# Altium schematic sheet CAN_controller.SchDoc: MCORD AFE
size 420 x 297 mm; Author: G.Kasprowicz; CompanyName: WUT ISE; DrawnBy: G.Kasprowicz; Organization: WUT ISE; Address1: PW ISE; Address2: Nowowiejska 15/19 00-665 Warsaw; Address3: gkasprow@gmail.com; DocumentNumber: 3; Revision: 2; SheetNumber: 3; SheetTotal: 4; ModifiedBy: -; CheckedDate: -; Title2: CAN controller; DivGrp: WUT ISE; Designer: G.Kasprowicz; ModifiedDate: -; ProjectName: Sensor Box
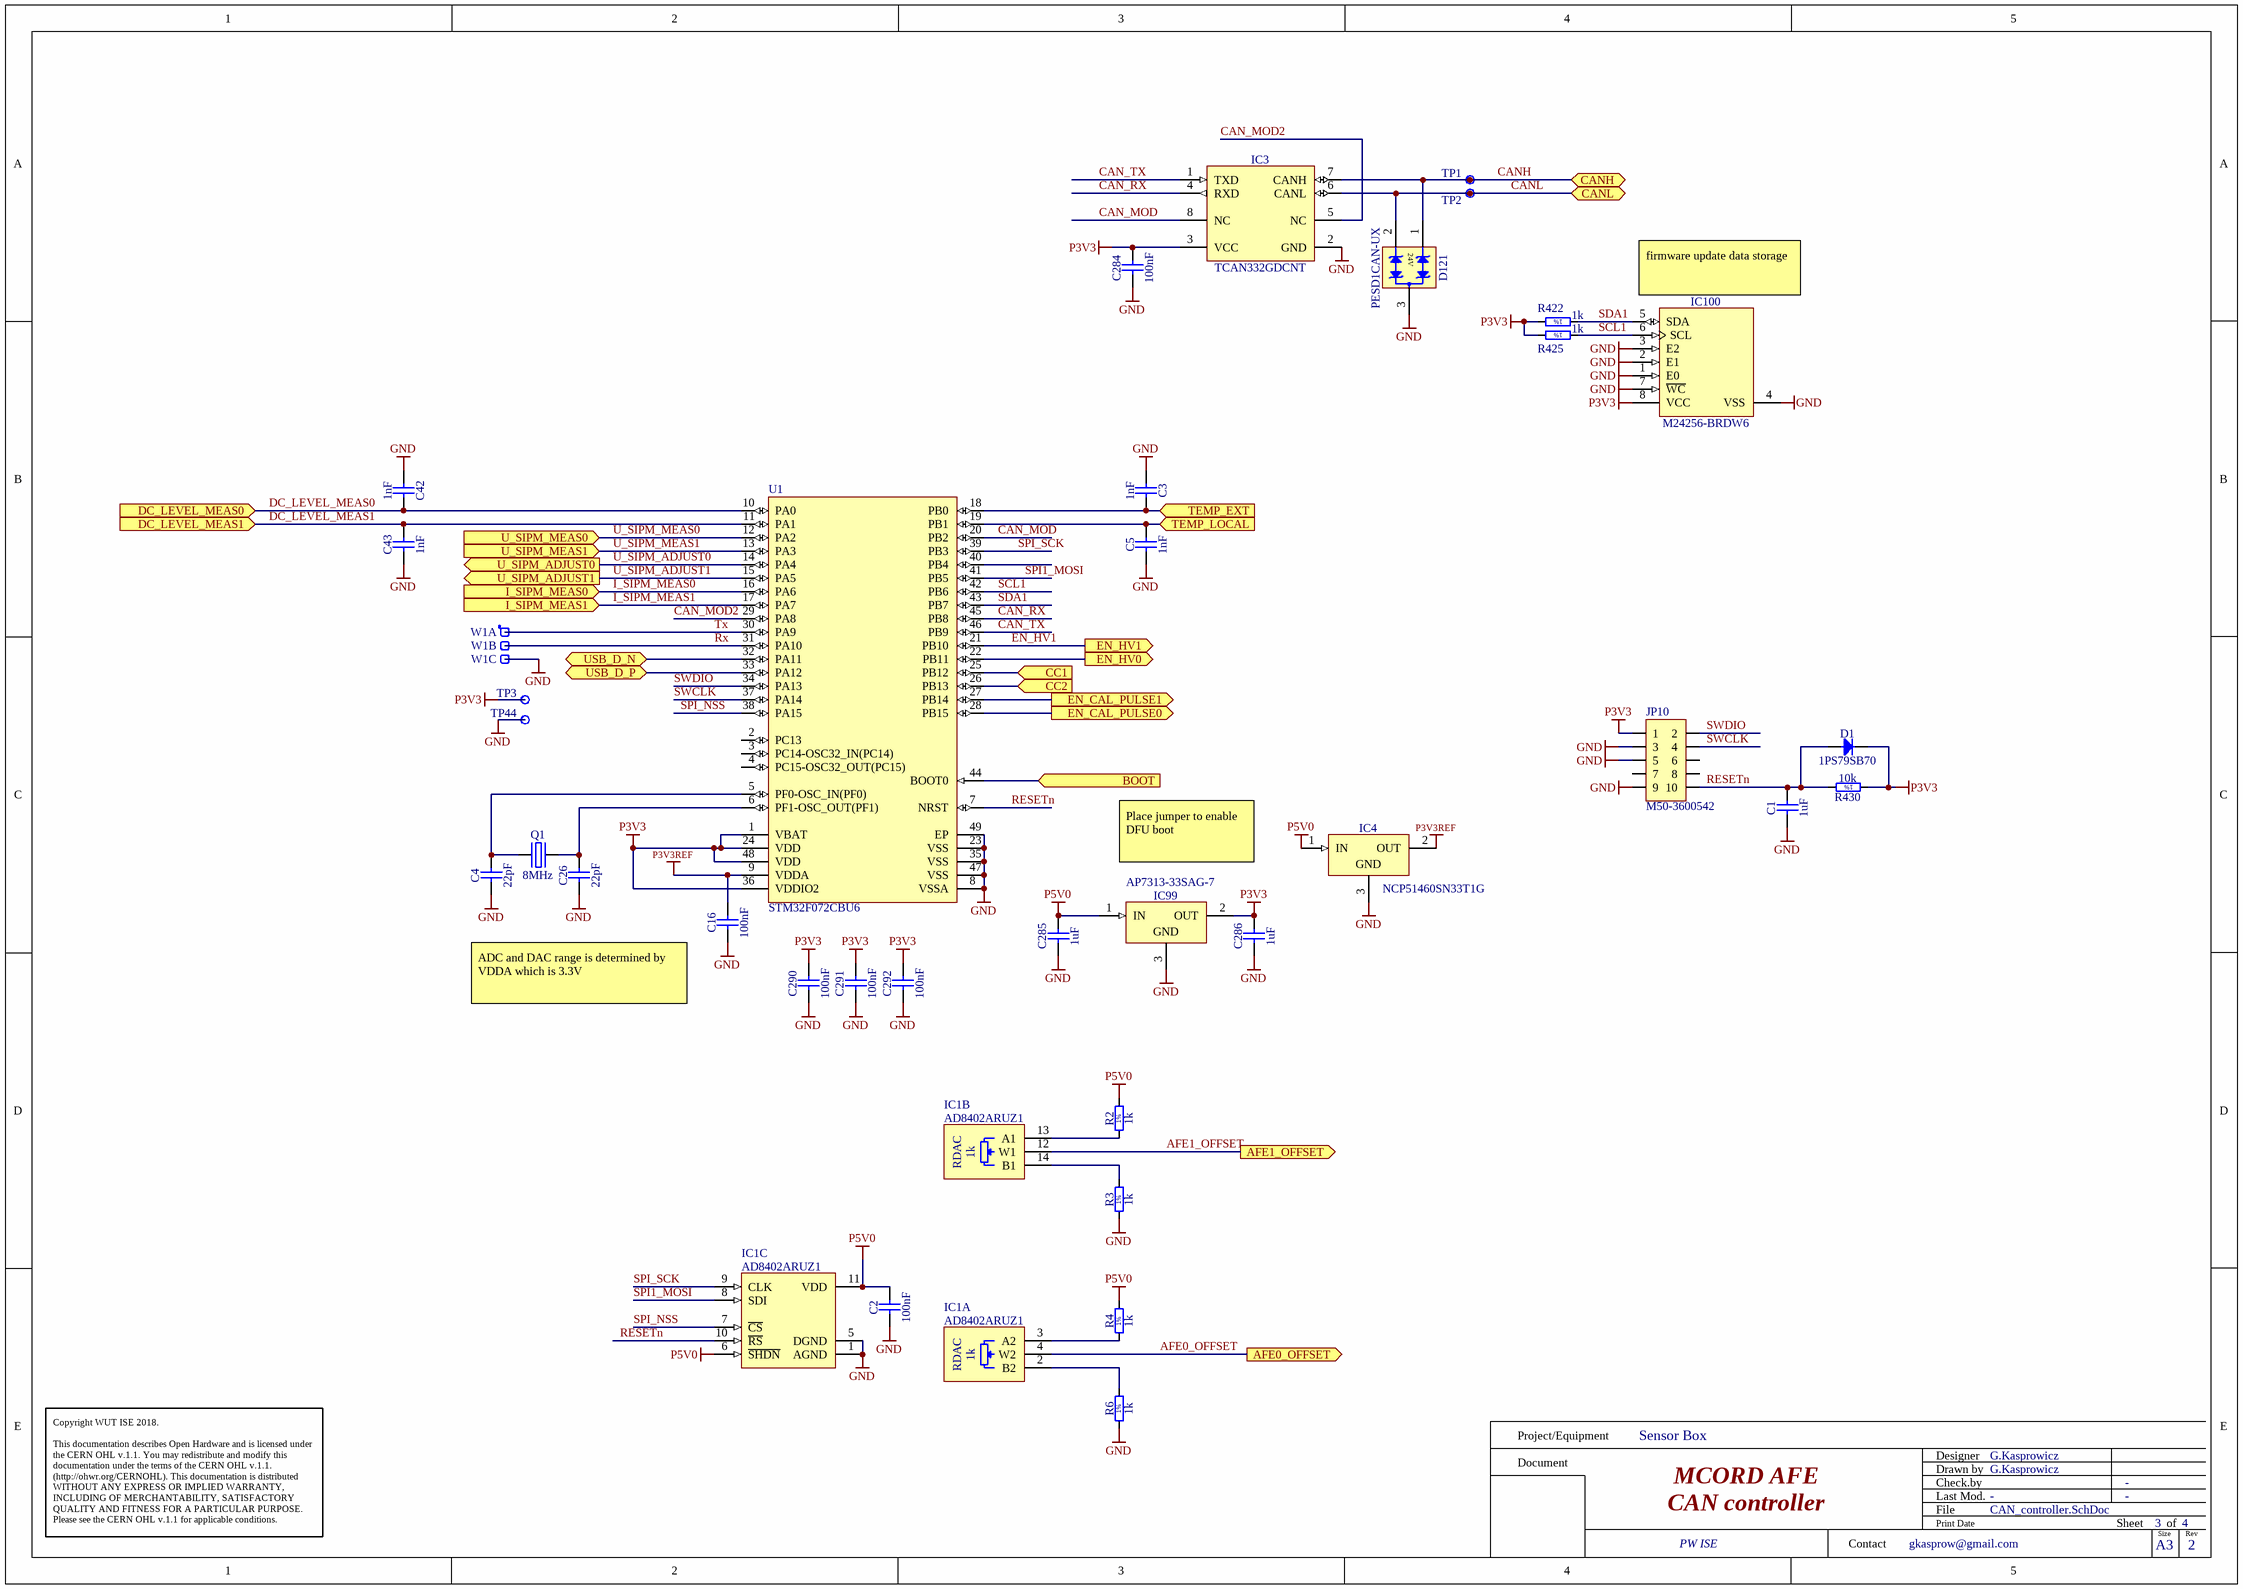
[diagram p0: CAN_controller.SchDoc]

## Parts
C1  1uF  [CAPC1608X87N]
C2  100nF  [CAPC1005X55N]
C3  1nF  [CAPC1005X55N]
C4  22pF  [CAPC1005X55N]
C5  1nF  [CAPC1005X55N]
C16  100nF  [CAPC1005X55N]
C26  22pF  [CAPC1005X55N]
C42  1nF  [CAPC1005X55N]
C43  1nF  [CAPC1005X55N]
C284  100nF  [CAPC1005X55N]
C285  1uF  [CAPC1608X87N]
C286  1uF  [CAPC1608X87N]
C290  100nF  [CAPC1005X55N]
C291  100nF  [CAPC1005X55N]
C292  100nF  [CAPC1005X55N]
D1  1PS79SB70  [SODFL1608X65N]
D121  PESD1CAN-UX  [SOT95P237X112-3N]
IC1  AD8402ARUZ1  [SOP65P640X120-14N]  (parts A,B,C of 3)
IC3  TCAN332GDCNT  [SOT65P280X145-8N]
IC4  NCP51460SN33T1G  [SOT95P240X110-3N]
IC99  AP7313-33SAG-7  [SOT95P240X130-3N]
IC100  M24256-BRDW6  [SOP65P640X120-8N]
JP10  M50-3600542  [PLHTD10S-TR-CV]
Q1  8MHz  [XTAL_TXC_7A]
R2  1k  [RESC1005X40N]
R3  1k  [RESC1005X40N]
R4  1k  [RESC1005X40N]
R6  1k  [RESC1005X40N]
R422  1k  [RESC1005X40N]
R425  1k  [RESC1005X40N]
R430  10k  [RESC1005X40N]
TP1  Test Point  [TPS127]  (value not drawn)
TP2  Test Point  [TPS127]  (value not drawn)
TP3  Test Point  [TPS127]  (value not drawn)
TP44  Test Point  [TPS127]  (value not drawn)
U1  STM32F072CBU6  [STM-UFQFPN48_L]
W1  Header 3  [SAMTEC_HTSW-103-23-L-S]  (value not drawn)  (parts A,B,C of 3)

## Ports
AFE0_OFFSET (out), AFE1_OFFSET (out), BOOT (in), CANH (bidir), CANL (bidir), CC1 (in), CC2 (in), DC_LEVEL_MEAS0 (in), DC_LEVEL_MEAS1 (in), EN_CAL_PULSE0 (out), EN_CAL_PULSE1 (out), EN_HV0 (out), EN_HV1 (out), I_SIPM_MEAS0 (in), I_SIPM_MEAS1 (in), TEMP_EXT (in), TEMP_LOCAL (in), U_SIPM_ADJUST0 (out), U_SIPM_ADJUST1 (out), U_SIPM_MEAS0 (in), U_SIPM_MEAS1 (in), USB_D_N (bidir), USB_D_P (bidir)

## Nets
GND: C1.1 C2.1 C3.1 C4.1 C5.1 C16.1 C26.1 C42.1 C43.1 C284.1 C285.1 C286.1 C290.1 C291.1 C292.1 D121.3(GND) IC1.1(AGND) IC1.5(DGND) IC3.2(GND) IC4.3(GND) IC99.3(GND) IC100.1(E0) IC100.2(E1) IC100.3(E2) IC100.4(VSS) IC100.7(~{WC}) JP10.3 JP10.5 JP10.9 R3.1 R6.1 TP44.1 U1.8(VSSA) U1.23(VSS) U1.35(VSS) U1.47(VSS) U1.49(EP) W1.3
P3V3: C284.2 C286.2 C290.2 C291.2 C292.2 D1.1(C) IC3.3(VCC) IC99.2(OUT) IC100.8(VCC) JP10.1 R422.2 R425.2 R430.1 TP3.1 U1.1(VBAT) U1.24(VDD) U1.36(VDDIO2) U1.48(VDD)
P3V3REF: C16.2 IC4.2(OUT) U1.9(VDDA)
P5V0: C2.2 C285.2 IC1.6(~{SHDN}) IC1.11(VDD) IC4.1(IN) IC99.1(IN) R2.2 R4.2
AFE0_OFFSET: IC1.4(W2) ; port AFE0_OFFSET
AFE1_OFFSET: IC1.12(W1) ; port AFE1_OFFSET
BOOT: U1.44(BOOT0) ; port BOOT
CAN_MOD: IC3.8(NC) U1.20(PB2)
CAN_MOD2: IC3.5(NC) U1.29(PA8)
CAN_RX: IC3.4(RXD) U1.45(PB8)
CAN_TX: IC3.1(TXD) U1.46(PB9)
CANH: D121.1(I/O1) IC3.7(CANH) TP1.1 ; port CANH
CANL: D121.2(I/O2) IC3.6(CANL) TP2.1 ; port CANL
CC1: U1.25(PB12) ; port CC1
CC2: U1.26(PB13) ; port CC2
DC_LEVEL_MEAS0: C42.2 U1.10(PA0) ; port DC_LEVEL_MEAS0
DC_LEVEL_MEAS1: C43.2 U1.11(PA1) ; port DC_LEVEL_MEAS1
EN_CAL_PULSE0: U1.28(PB15) ; port EN_CAL_PULSE0
EN_CAL_PULSE1: U1.27(PB14) ; port EN_CAL_PULSE1
EN_HV0: U1.22(PB11) ; port EN_HV0
EN_HV1: U1.21(PB10) ; port EN_HV1
I_SIPM_MEAS0: U1.16(PA6) ; port I_SIPM_MEAS0
I_SIPM_MEAS1: U1.17(PA7) ; port I_SIPM_MEAS1
RESETn: C1.2 D1.2(A) IC1.10(~{RS}) JP10.10 R430.2 U1.7(NRST)
Rx: U1.31(PA10) W1.2
SCL1: IC100.6(SCL) R425.1 U1.42(PB6)
SDA1: IC100.5(SDA) R422.1 U1.43(PB7)
SPI1_MOSI: IC1.8(SDI) U1.41(PB5)
SPI_NSS: IC1.7(~{CS}) U1.38(PA15)
SPI_SCK: IC1.9(CLK) U1.39(PB3)
SWCLK: JP10.4 U1.37(PA14)
SWDIO: JP10.2 U1.34(PA13)
TEMP_EXT: C3.2 U1.18(PB0) ; port TEMP_EXT
TEMP_LOCAL: C5.2 U1.19(PB1) ; port TEMP_LOCAL
Tx: U1.30(PA9) W1.1
U_SIPM_ADJUST0: U1.14(PA4) ; port U_SIPM_ADJUST0
U_SIPM_ADJUST1: U1.15(PA5) ; port U_SIPM_ADJUST1
U_SIPM_MEAS0: U1.12(PA2) ; port U_SIPM_MEAS0
U_SIPM_MEAS1: U1.13(PA3) ; port U_SIPM_MEAS1
USB_D_N: U1.32(PA11) ; port USB_D_N
USB_D_P: U1.33(PA12) ; port USB_D_P
NetC4_2: C4.2 Q1.1(OSC1) U1.5(PF0-OSC_IN(PF0))
NetC26_2: C26.2 Q1.2(OSC2) U1.6(PF1-OSC_OUT(PF1))
NetIC1_2: IC1.2(B2) R6.2
NetIC1_3: IC1.3(A2) R4.1
NetIC1_13: IC1.13(A1) R2.1
NetIC1_14: IC1.14(B1) R3.2

Not connected (* = marked no-connect by the designer): JP10 6 7 8; U1 2(PC13) 3(PC14-OSC32_IN(PC14)) 4(PC15-OSC32_OUT(PC15)) 40(PB4)

## Notes on the sheet
- (near IC100) firmware update data storage
- Place jumper to enable DFU boot
- ADC and DAC range is determined by VDDA which is 3.3V
- Project/Equipment
- Document
- Designer
- Drawn by
- Check.by
- Copyright WUT ISE 2018.
  This documentation describes Open Hardware and is licensed under the CERN OHL v.1.1. You may redistribute and modify this documentation under the terms of the CERN OHL v.1.1. (http://ohwr.org/CERNOHL). This documentation is distributed WITHOUT ANY EXPRESS OR IMPLIED WARRANTY, INCLUDING OF MERCHANTABILITY, SATISFACTORY QUALITY AND FITNESS FOR A PARTICULAR PURPOSE. Please see the CERN OHL v.1.1 for applicable conditions.
- Contact
- File
- Last Mod.
- Print Date
- Sheet
- Size
- A3
- of
- Rev
- (in symbol DAC_AD8402ARUZ1, part A) RDAC; 1k
- (in symbol DAC_AD8402ARUZ1, part B) RDAC; 1k
- (in symbol R0402_1K_1%_0.0625W_100PPM) 1%
- (in symbol R0402_10K_1%_0.0625W_100PPM) 1%

## Library data of the parts
C1 C285 C286 = CC0603_1UF_16V_10%_X7R: Non-polarised capacitor; Part Description: SMD Multilayer Chip Ceramic Capacitor; Manufacturer: GENERIC; Manufacturer1 Part Number: 223878615663; Voltage: 16V; TC: X7R; Tolerance: ±10%; Part Number: CC0603_1UF_16V_10%_X7R; Component Kind: Standard; Component Type: Standard; Pin Count: 2; Value: 1uF; Status: None; Manufacturer Part Number: CC0603_1uF_16V_10%_X7R; Case: 0603; Mounted: Yes; Socket: No; SMD: Yes; Sense: No; Manufacturer1 Example: YAGEO PHYCOMP; Manufacturer1 ComponentHeight: 0.9mm; HelpURL: \\cern.ch\dfs\Applications\Altium\Datasheets\CC0603_X7R_PHYCOMP.pdf; Author: CERN DEM JLC; CreateDate: 03.12.2007; LatestRevisionDate: 17.04.2015
C2 C16 C284 C290-C292 = CC0402_100NF_16V_10%_X7R: Non-polarised capacitor; Part Description: SMD Multilayer Chip Ceramic Capacitor; Manufacturer: GENERIC; Manufacturer1 Part Number: GRM155R71C104KA88D; Voltage: 16V; TC: X7R; Tolerance: ±10%; Part Number: CC0402_100NF_16V_10%_X7R; Component Kind: Standard; Component Type: Standard; Pin Count: 2; Value: 100nF; Status: Not Recommended; Manufacturer Part Number: CC0402_100NF_16V_10%_X7R; Case: 0402; Mounted: Yes; Socket: No; SMD: Yes; Sense: No; HelpURL: \\cern.ch\dfs\Applications\Altium\Datasheets\CC0402_X7R_MURATA_GRM.pdf; Author: CERN DEM JLC; CreateDate: 05.12.2013; LatestRevisionDate: 03.12.2007; Manufacturer1 Example: MURATA; Manufacturer1 ComponentHeight: 0.55mm
C3 C5 C42 C43 = CC0402_1NF_50V_5%_C0G: Non-polarised capacitor; Part Description: SMD Multilayer Chip Ceramic Capacitor; Manufacturer: GENERIC; Manufacturer1 Part Number: C0402C102J5GACTU; Voltage: 50V; TC: C0G/NP0; Tolerance: ±5%; Part Number: CC0402_1NF_50V_5%_C0G; Component Kind: Standard; Component Type: Standard; Pin Count: 2; Value: 1nF; Status: Preferred; Manufacturer Part Number: CC0402_1NF_50V_5%_C0G; Case: 0402; Mounted: Yes; Socket: No; SMD: Yes; Sense: No; Manufacturer1 Example: KEMET; Manufacturer1 ComponentHeight: 0.55mm; HelpURL: \\cern.ch\dfs\Applications\Altium\Datasheets\CC0402_C0G_KEMET_(Commercial Grade).pdf; Author: CERN DEM BC; CreateDate: 02/09/2019; LatestRevisionDate: 02/09/2019
C4 C26 = CC0402_22PF_50V_5%_C0G: Non-polarised capacitor; Part Description: SMD Multilayer Chip Ceramic Capacitor; Manufacturer: GENERIC; Manufacturer1 Part Number: C0402C220J5GACTU; Voltage: 50V; TC: C0G/NP0; Tolerance: ±5%; Part Number: CC0402_22PF_50V_5%_C0G; Component Kind: Standard; Component Type: Standard; Pin Count: 2; Value: 22pF; Status: Preferred; Manufacturer Part Number: CC0402_22PF_50V_5%_C0G; Case: 0402; Mounted: Yes; Socket: No; SMD: Yes; Sense: No; Manufacturer1 Example: KEMET; Manufacturer1 ComponentHeight: 0.55mm; HelpURL: \\cern.ch\dfs\Applications\Altium\Datasheets\CC0805_C0G_KEMET_(Commercial Grade).pdf; Author: CERN DEM JLC; CreateDate: 03.12.2007; LatestRevisionDate: 03.12.2007
D1 = D_1PS79SB70: Diode; Part Description: High-speed switching diode; Manufacturer: NEXPERIA; Voltage: 70V; Power: 70mA; PressFit: No; Bonding: No; Part Number: 1PS79SB70; Component Kind: Standard; Component Type: Standard; Device: 1PS79SB70; PackageDescription: Ultra Small Outline Diode Flat Lead (SOD-523), Body; 1.2mm L X 0.8mm W X 0.65mm H, IPC Medium Density; Manufacturer Part Number: 1PS79SB70; Pin Count: 2; Case: SOD523; Mounted: Yes; Socket: No; SMD: Yes; Sense: No; ComponentHeight: 0.65mm; HelpURL: \\cern.ch\dfs\Applications\Altium\Datasheets\BAS516.pdf; Author: GK; CreateDate: 11/09/2018; LatestRevisionDate: 11/09/2018
D121 = D_TVS_PESD1CAN: TVS Diode for CAN; Manufacturer: Nexperia; Voltage: 24V; Power: 400W; PressFit: No; Bonding: No; Part Number: PESD1CAN-UX; Component Kind: Standard; Component Type: Standard; Device: PESD1CAN-UX; PackageDescription: SOT, 0.95mm, pitch; 3 pin,1.30mm W X 2.92mm L X 1.12mm H body, IPC Medium Density; Part Description: TVS Diode for CAN; Manufacturer Part Number: PESD1CAN-UX; Pin Count: 3; Case: SOT-23; Mounted: Yes; Socket: No; SMD: Yes; Sense: No; ComponentHeight: 1.12mm; HelpURL: \\cern.ch\dfs\Applications\Altium\Datasheets\SM712.TCT.pdf; Author: CERN DEM JLC; CreateDate: 03.09.2014; LatestRevisionDate: 13.01.2015
IC1 = DAC_AD8402ARUZ1: 2-Channel 1k Digital Potentiometer; Manufacturer: ANALOG DEVICES; PressFit: No; Bonding: No; Part Number: AD8402ARUZ1; Component Kind: Standard; Component Type: Standard; Device: AD8402ARUZ1; PackageDescription: SOP, 14-Leads, Body 5.1x4.5mm (max), Pitch 0.65mm, IPC Medium Density; Part Description: 2-Channel 1k Digital Potentiometer; Manufacturer Part Number: AD8402ARUZ1; Pin Count: 14; Case: TSSOP14; Mounted: Yes; Socket: No; SMD: Yes; Sense: No; ComponentHeight: 1.75mm; Author: GK; HelpURL: \\cern.ch\dfs\Applications\Altium\Datasheets\AD8402ARZ1.pdf; CreateDate: 09/11/2016; LatestRevisionDate: 09/11/2016
IC3 = TCAN332GDCNT: 3.3V CAN Transceivers with CAN FD (Flexible Data Rate); Manufacturer: TEXAS INSTRUMENTS; PressFit: No; Bonding: No; Part Number: TCAN332GDCNT; Component Kind: Standard; Component Type: Standard; Device: TCAN332GDCNT; PackageDescription: SOT, 0.65mm Pitch; 8 pin, 1.625mm W X 2.90mm L X 1.45mm H body, IPC Medium Density; Part Description: 3.3V CAN Transceivers with CAN FD (Flexible Data Rate); Manufacturer Part Number: TCAN332GDCNT; Pin Count: 8; Case: SOT23-8; Mounted: Yes; Socket: No; SMD: Yes; Sense: No; ComponentHeight: 1.45mm; Author: CERN DEM JLC; HelpURL: \\cern.ch\dfs\Applications\Altium\Datasheets\TCAN332GDCNT.pdf; CreateDate: 22/08/2017; LatestRevisionDate: 22/08/2017
IC4 = NCP51460SN33T1G: 3-Terminal Regulator 1=IN 2=OUT 3=GND; Part Description: 3.3V, 20mA Micropower Precision Voltage Reference; Manufacturer: ON SEMICONDUCTOR; PressFit: No; Bonding: No; Part Number: NCP51460SN33T1G; Component Kind: Standard; Component Type: Standard; Device: NCP51460SN33T1G; PackageDescription: SOT23 3-Leads, Pitch 0.95mm - Body 1.4x3mm, IPC Medium Density; Manufacturer Part Number: NCP51460SN33T1G; Pin Count: 3; Case: SOT23; Mounted: Yes; Socket: No; SMD: Yes; Sense: No; ComponentHeight: 1.1mm; HelpURL: \\cern.ch\dfs\Applications\Altium\Datasheets\NCP51460SN33T1G.pdf; Author: CERN DEM MR; CreateDate: 05.10.2016; LatestRevisionDate: 05.10.2016
IC99 = AP7313-33SAG-7: 3-Terminal Regulator 1=IN 2=OUT 3=GND; Part Description: 3.3V, 150mA Low Quiescent Current, Fast Transient Low Dropout Linear Regulator; Manufacturer: DIODES INCORPORATED; PressFit: No; Bonding: No; Part Number: AP7313-33SAG-7; Component Kind: Standard; Component Type: Standard; Device: AP7313-33SAG-7; PackageDescription: SOT23 3-Leads, Pitch 0.95mm - Body 1.3x2.9mm, IPC Medium Density; Manufacturer Part Number: AP7313-33SAG-7; Pin Count: 3; Case: SOT23; Mounted: Yes; Socket: No; SMD: Yes; Sense: No; ComponentHeight: 1.35mm; HelpURL: \\cern.ch\dfs\Applications\Altium\Datasheets\AP7313-33SAG-7.pdf; Author: CERN DEM JLC; CreateDate: 20.03.2018; LatestRevisionDate: 20.03.2018
IC100 = MEM_M24256-BRDW6P: 256-Kbit Serial I²C Bus EEPROM; Manufacturer: ST MICROELECTRONICS; PressFit: No; Bonding: No; Part Number: M24256-BRDW6P; Component Kind: Standard; Component Type: Standard; Device: M24256-BRDW6; PackageDescription: SOP, 0.65mm pitch; 8 pin, 4.40mm W X 3.00mm L X 1.20mm H body, IPC Medium Density; Part Description: 256-Kbit Serial I²C Bus EEPROM; Manufacturer Part Number: M24256-BRDW6; Pin Count: 8; Case: TSSOP8; Mounted: Yes; Socket: No; SMD: Yes; Sense: No; ComponentHeight: 1.2mm; HelpURL: \\cern.ch\dfs\Applications\Altium\Datasheets\M24256-BRDW6P.pdf; Author: CERN DEM MR; CreateDate: 17.03.2016; LatestRevisionDate: 17.03.2016
JP10 = CON_2x5 1.27 SMT Male: 1.27 mm dual row goldpin (Harwin)
Q1 = XTAL_8MHZ_TXC_7A-8.000MAAE-T: Quartz Crystal; Part Description: Tolerance: ±30ppm, Stability: ±30ppm, -20°C to +70°C, 12pF, SMD Glass Seam Sealing Crystal, 7A Series; Manufacturer: TXC CORPORATION; PressFit: No; Bonding: No; Part Number: XTAL_8MHZ_TXC_7A-8.000MAAE-T; Component Kind: Standard; Component Type: Standard; PackageDescription: 2 Pins, 3.2x5mm, SMD Glass Seam Sealing Crystal, 7A Serie; Value: 8MHz; Manufacturer Part Number: 7A-8.000MAAE-T; Pin Count: 2; Mounted: Yes; Socket: No; SMD: Yes; Sense: No; ComponentHeight: 1.2mm; HelpURL: \\cern.ch\dfs\Applications\Altium\Datasheets\XTAL_TXC_7A.pdf; Author: CERN DEM JLC; CreateDate: 09.10.2014; LatestRevisionDate: 12.11.2014
R2-R4 R6 R422 R425 = R0402_1K_1%_0.0625W_100PPM: Resistor - 1%; Part Description: General Purpose Thick Film Chip Resistor; Manufacturer: GENERIC; Manufacturer1 Part Number: 232270671002L; TC: ±100ppm/°C; PressFit: No; Part Number: R0402_1K_1%_0.0625W_100PPM; Component Kind: Standard; Component Type: Standard; Pin Count: 2; Value: 1k; Status: Not Recommended; Power: 0.0625W; Tolerance: ±1%; Manufacturer Part Number: R0402_1K_1%_0.0625W_100PPM; Case: 0402; Mounted: Yes; Sense: No; Socket: No; SMD: Yes; Manufacturer1 Example: YAGEO PHYCOMP; Manufacturer1 ComponentHeight: 0.4mm; HelpURL: \\cern.ch\dfs\Applications\Altium\Datasheets\R0402_Phycomp_RC0402.pdf; Author: CERN DEM JLC
  R2-R4 R6: CreateDate: 03/12/2007; LatestRevisionDate: 17/10/2012
  R422 R425: CreateDate: 03.12.2007; LatestRevisionDate: 17.10.2012
R430 = R0402_10K_1%_0.0625W_100PPM: Resistor - 1%; Part Description: General Purpose Thick Film Chip Resistor; Manufacturer: GENERIC; Manufacturer1 Part Number: 232270671003L; TC: ±100ppm/°C; PressFit: No; Part Number: R0402_10K_1%_0.0625W_100PPM; Component Kind: Standard; Component Type: Standard; Pin Count: 2; Value: 10k; Status: Not Recommended; Power: 0.0625W; Tolerance: ±1%; Manufacturer Part Number: R0402_10K_1%_0.0625W_100PPM; Case: 0402; Mounted: Yes; Sense: No; Socket: No; SMD: Yes; Manufacturer1 Example: YAGEO PHYCOMP; Manufacturer1 ComponentHeight: 0.4mm; HelpURL: \\cern.ch\dfs\Applications\Altium\Datasheets\R0402_Phycomp_RC0402.pdf; Author: CERN DEM JLC; CreateDate: 03.12.2007; LatestRevisionDate: 17.10.2012
TP1-TP3 TP44 = SMD_PAD_1.27X1.27MM: Part Description: 1.27mm x 1.27mm PCB Copper Area (SMD Test Point); Mounted: No; Part Number: SMD_PAD_1.27X1.27MM; Component Kind: Standard (No BOM); Component Type: Standard (No BOM); Pin Count: 1; Family: Test Point; Socket: No; SMD: Yes; Sense: No; Status: None; ComponentHeight: 0mm; HelpURL: Undefined; Author: CERN DEM JLC; CreateDate: 12.01.2008; LatestRevisionDate: 12.01.2008; PackageDescription: 1.27mm x 1.27mm PCB Copper Area (SMD Test Point)
U1 = CMP-0304-00173-2: ARM Cortex-M0 32-bit MCU, 128 KB Flash, 16 KB Internal RAM, 37 I/Os, 48-Pin UFQFPN, -40 to 85 degC, Tray; Manufacturer: STMicroelectronics; I/Os (High Current): 37; FLASH Size (Prog) (kB): 128; Supply Voltage(Vcc) min (V): 2; Internal RAM Size (kB): 16; D/A Converter: 1; Operating Frequency(F) (Processor speed) (MHz): 48; Package Reference: UFQFPN48; ComponentLink2Description: Datasheet; ComponentLink2URL: http://www.st.com/st-web-ui/static/active/en/resource/technical/document/datasheet/DM00090510.pdf; Package Description: 48-Pin Ultra Thin Fine Pitch Quad Flat No-Lead, 7 x 7 x 0.6 mm Body, 0.5 mm Pitch, Exposed Pad; Mounting Technology: Surface Mount; Packing: Tray; ComponentLink1URL: http://www.st.com/; ComponentLink1Description: Manufacturer URL; DatasheetVersion: Rev. 5; PartNumber: STM32F072CBU6; Core: ARM Cortex-M0
W1 = SAMTEC_HTSW-103-23-L-S: 3 Mini Wire-Wrap Contact Strip Header; Part Description: 3 Contacts, Pitch 2.54mm, Single Row  Through Mount Straight Header (Post Lead 5.84mm, Tail Lead 2.92mm, Insulator 2.54mm); Manufacturer: SAMTEC; PressFit: No; Status Comment: High Temperature; Part Number: SAMTEC_HTSW-103-23-L-S; Component Kind: Standard; Component Type: Standard; Pin Count: 3; Family: Header 3; Mounted: Yes; Socket: No; SMD: No; Sense: No; Status: Preferred; Manufacturer Part Number: HTSW-103-23-L-S; ComponentHeight: 8.38mm; HelpURL: \\cern.ch\dfs\Applications\Altium\Datasheets\SAMTEC_HTSW-103-23-L-S.pdf; Author: CERN DEM JLC; CreateDate: 22/02/2018; LatestRevisionDate: 22/02/2018